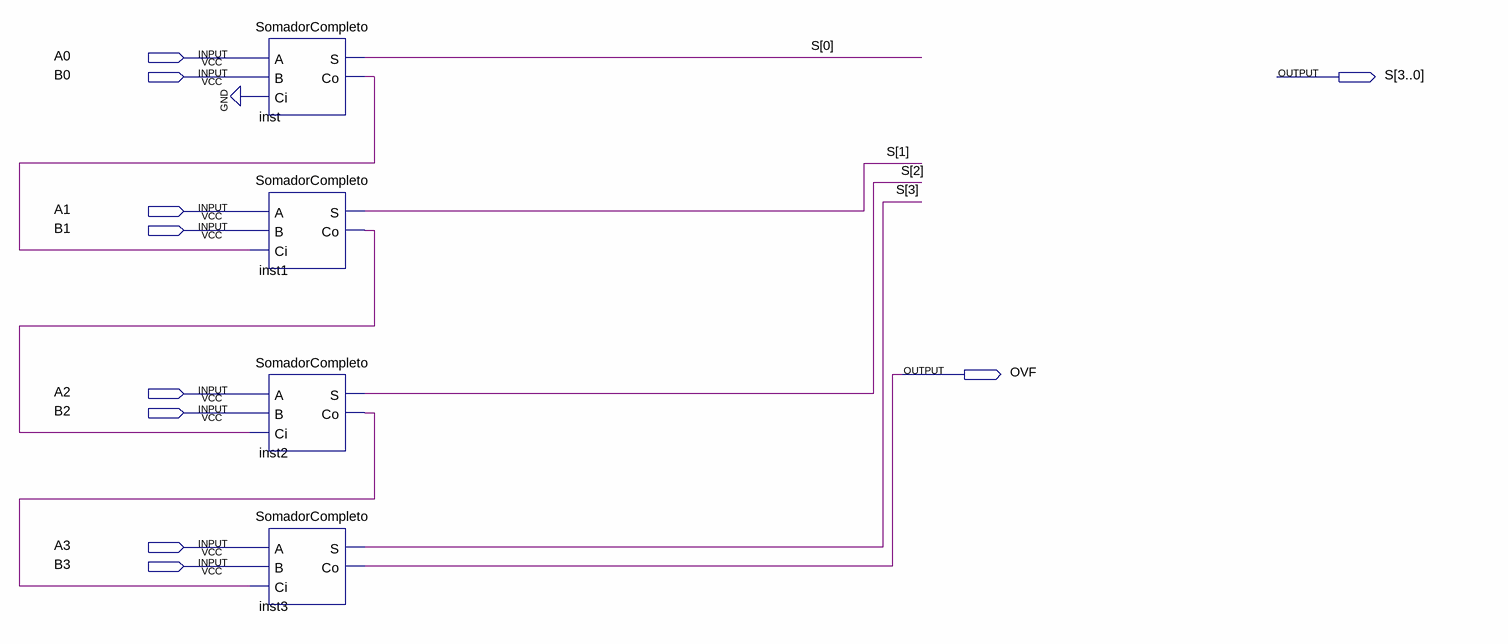
[diagram p0: schematic sheet]
// Quartus schematic Aula06.bdf as structural Verilog: 4 symbols, 10 pins
module Aula06 (
  input  A0,
  input  B0,
  input  A1,
  input  B1,
  input  A2,
  input  B2,
  input  A3,
  input  B3,
  output [3:0] S,
  output OVF
);

  wire inst1_co, inst2_co, inst_co;

  SomadorCompleto inst (.A(A0), .B(B0), .Ci(1'b0), .S(S[0]), .Co(inst_co));
  SomadorCompleto inst1 (.A(A1), .B(B1), .Ci(inst_co), .S(S[1]), .Co(inst1_co));
  SomadorCompleto inst2 (.A(A2), .B(B2), .Ci(inst1_co), .S(S[2]), .Co(inst2_co));
  SomadorCompleto inst3 (.A(A3), .B(B3), .Ci(inst2_co), .S(S[3]), .Co(OVF));
endmodule
